# EAGLE design Development Board ATMega32 (EAGLE 7.6.0)

## Sheet 1 of 2
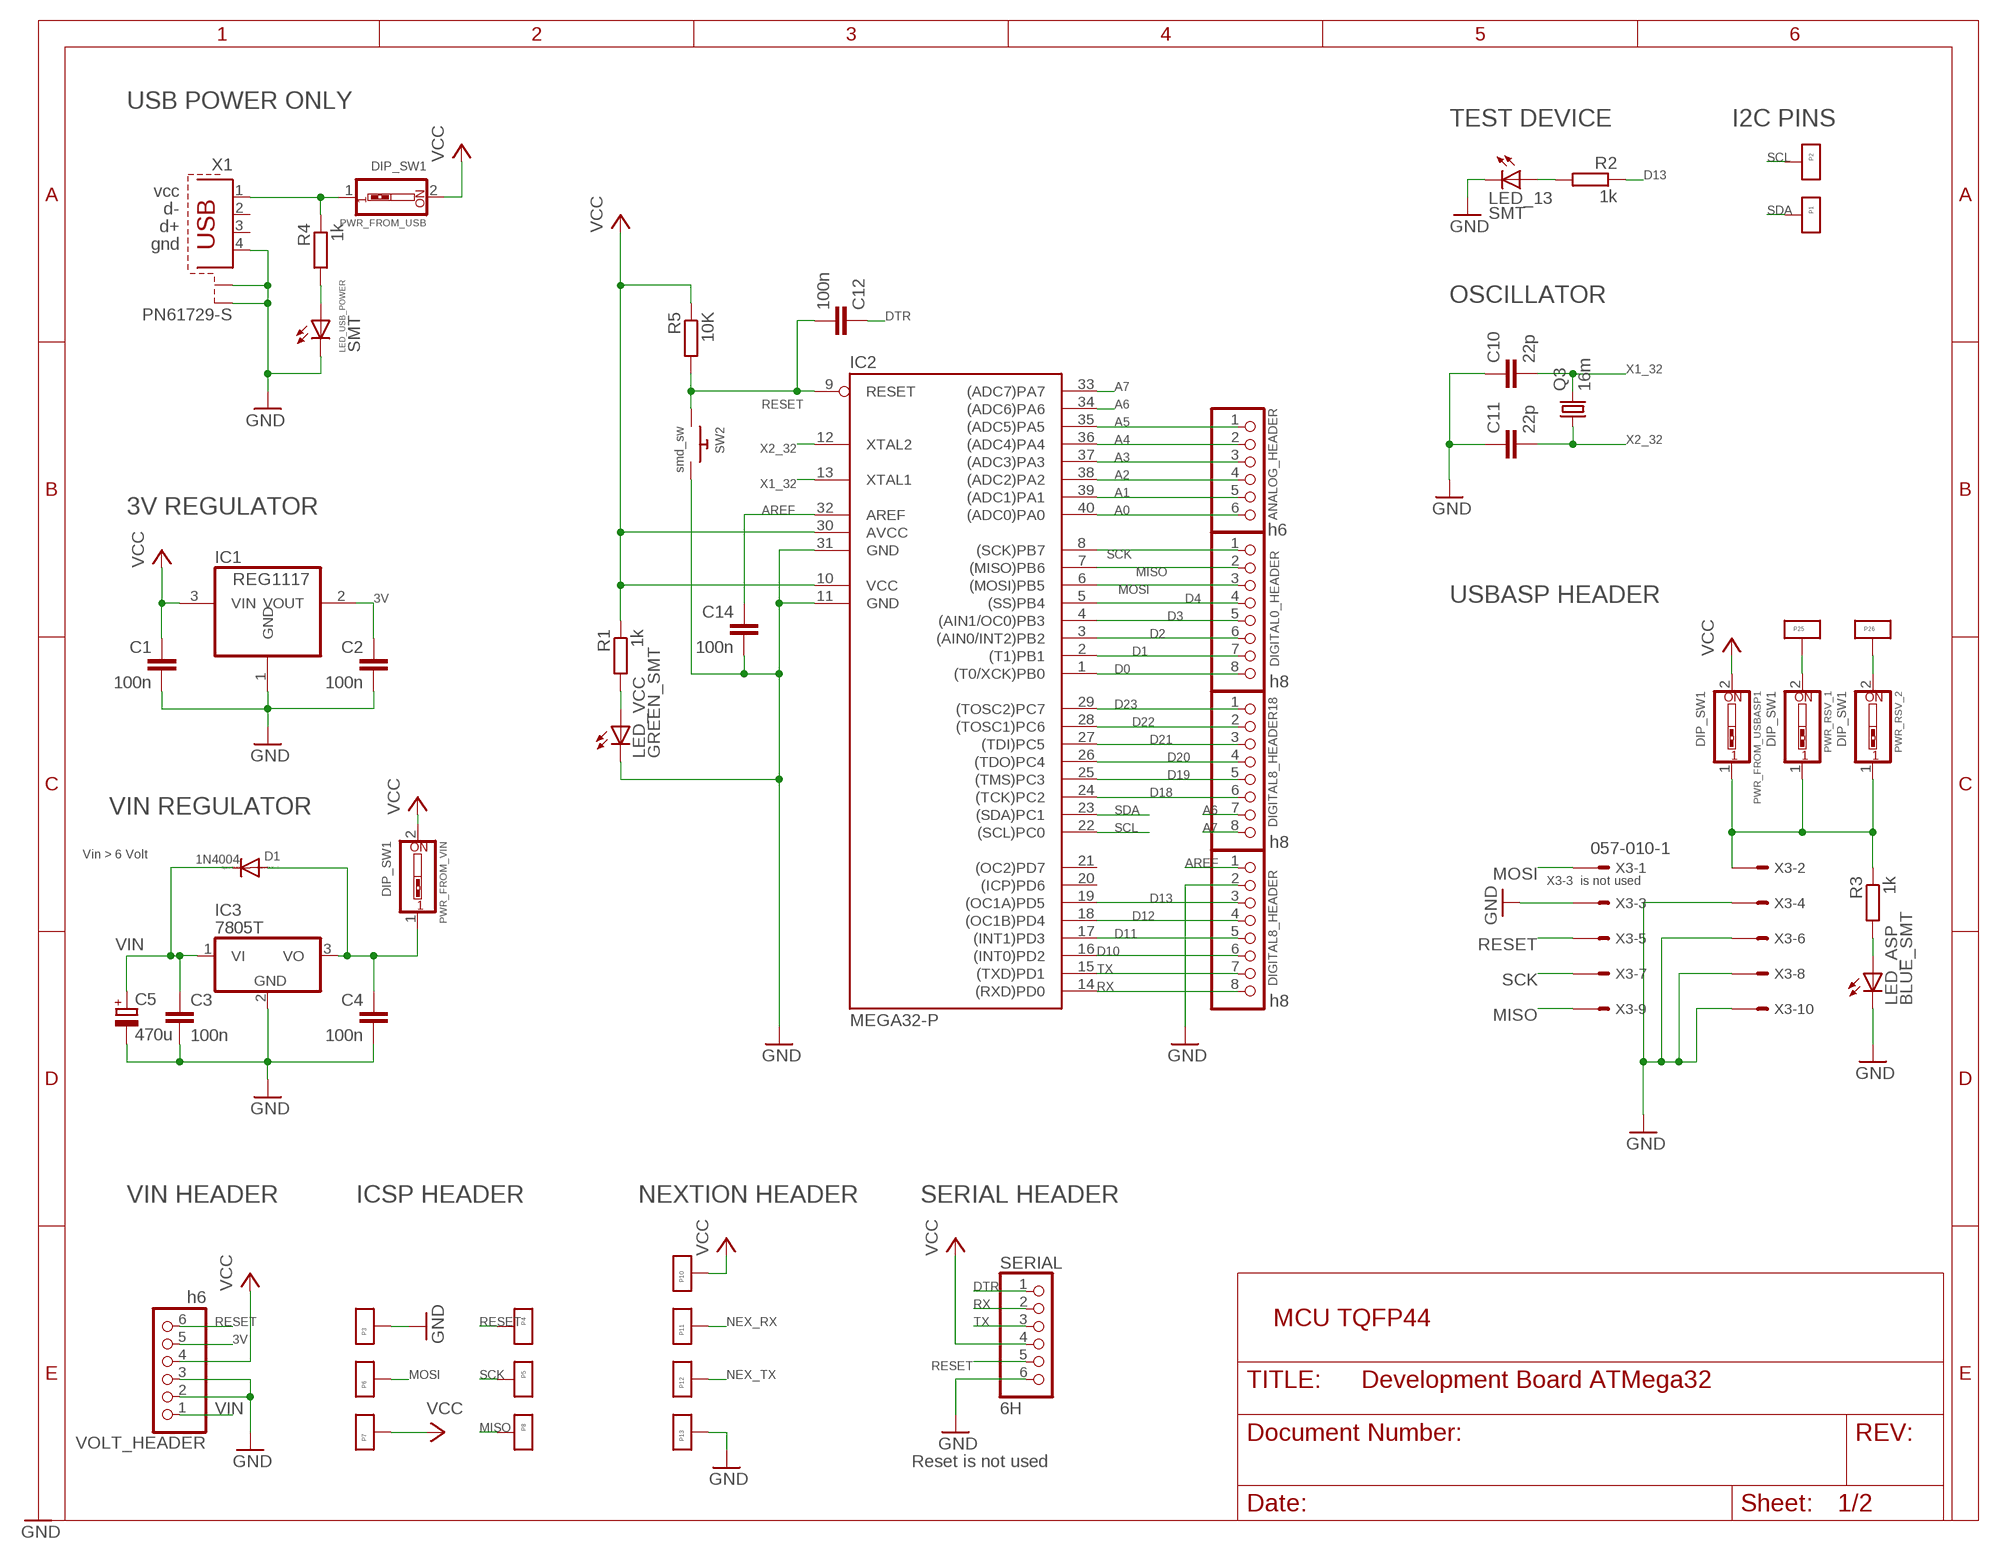
[diagram p0: schematic, sheet 1]

### Parts
ANALOG_HEADER  h6  PINHD-1X6  [1X06]
C1  100n  C-EUC1206  [C1206]
C2  100n  C-EUC1206  [C1206]
C3  100n  C-EU050-025X075  [C050-025X075]
C4  100n  C-EU050-025X075  [C050-025X075]
C5  470u  CPOL-EUE5-5  [E5-5]
C10  22p  C-EUC1206  [C1206]
C11  22p  C-EUC1206  [C1206]
C12  100n  C-EUC1206  [C1206]
C14  100n  C-EUC1206  [C1206]
D1  1N4004  [DO41-10]
DIGITAL0_HEADER  h8  PINHD-1X8BIG  [1X08-BIG]
DIGITAL8_HEADER  h8  PINHD-1X8BIG  [1X08-BIG]
DIGITAL8_HEADER18  h8  PINHD-1X8BIG  [1X08-BIG]
IC1  REG1117  [SOT223]
IC2  MEGA32-P  [DIL40]
IC3  7805T  [TO220H]
LED_13  SMT  LEDSMT1206  [1206]
LED_ASP  BLUE_SMT  LEDSMT1206  [1206]
LED_USB_POWER  SMT  LEDSMT1206  [1206]
LED_VCC  GREEN_SMT  LEDSMT1206  [1206]
P1  PIN-BIG1X  [PIN-BIG]
P2  PIN-BIG1X  [PIN-BIG]
P3  PIN-BIG1X  [PIN-BIG]
P4  PIN-BIG1X  [PIN-BIG]
P5  PIN-BIG1X  [PIN-BIG]
P6  PIN-BIG1X  [PIN-BIG]
P7  PIN-BIG1X  [PIN-BIG]
P8  PIN-BIG1X  [PIN-BIG]
P10  PIN-BIG1X  [PIN-BIG]
P11  PIN-BIG1X  [PIN-BIG]
P12  PIN-BIG1X  [PIN-BIG]
P13  PIN-BIG1X  [PIN-BIG]
P25  PIN-BIG1X  [PIN-BIG]
P26  PIN-BIG1X  [PIN-BIG]
PWR_FROM_USB  DIP_SW1  SW_DIP-1  [EDG-01]
PWR_FROM_USBASP1  DIP_SW1  SW_DIP-1  [EDG-01]
PWR_FROM_VIN  DIP_SW1  SW_DIP-1  [EDG-01]
PWR_RSV_1  DIP_SW1  SW_DIP-1  [EDG-01]
PWR_RSV_2  DIP_SW1  SW_DIP-1  [EDG-01]
Q3  16m  CRYSTALHC49UP  [HC49UP]
R1  1k  R-EU_R1206  [R1206]
R2  1k  R-EU_R1206  [R1206]
R3  1k  R-EU_R1206  [R1206]
R4  1k  R-EU_R1206  [R1206]
R5  10K  R-EU_R1206  [R1206]
SERIAL  6H  PINHD-1X6  [1X06]
SW2  smd_sw  SWITCH_PUSHBUTTONEVQ-PE  [TACT_PANA-EVQ]
VOLT_HEADER  h6  PINHD-1X6  [1X06]
X1  PN61729-S  [PN61729-S]
X3  057-010-1  [057-010-1]

### Nets
3V: C2.1 IC1.2(VOUT) VOLT_HEADER.5
A0: ANALOG_HEADER.6 IC2.40((ADC0)PA0)
A1: ANALOG_HEADER.5 IC2.39((ADC1)PA1)
A2: ANALOG_HEADER.4 IC2.38((ADC2)PA2)
A3: ANALOG_HEADER.3 IC2.37((ADC3)PA3)
A4: ANALOG_HEADER.2 IC2.36((ADC4)PA4)
A5: ANALOG_HEADER.1 IC2.35((ADC5)PA5)
A6: DIGITAL8_HEADER18.7 IC2.34((ADC6)PA6)
A7: DIGITAL8_HEADER18.8 IC2.33((ADC7)PA7)
AREF: C14.1 DIGITAL8_HEADER.1 IC2.32(AREF)
D0: DIGITAL0_HEADER.8 IC2.1((T0/XCK)PB0)
D1: DIGITAL0_HEADER.7 IC2.2((T1)PB1)
D2: DIGITAL0_HEADER.6 IC2.3((AIN0/INT2)PB2)
D3: DIGITAL0_HEADER.5 IC2.4((AIN1/OC0)PB3)
D4: DIGITAL0_HEADER.4 IC2.5((SS)PB4)
D10: DIGITAL8_HEADER.6 IC2.16((INT0)PD2)
D11: DIGITAL8_HEADER.5 IC2.17((INT1)PD3)
D12: DIGITAL8_HEADER.4 IC2.18((OC1B)PD4)
D13: DIGITAL8_HEADER.3 IC2.19((OC1A)PD5) R2.1
D18: DIGITAL8_HEADER18.6 IC2.24((TCK)PC2)
D19: DIGITAL8_HEADER18.5 IC2.25((TMS)PC3)
D20: DIGITAL8_HEADER18.4 IC2.26((TDO)PC4)
D21: DIGITAL8_HEADER18.3 IC2.27((TDI)PC5)
D22: DIGITAL8_HEADER18.2 IC2.28((TOSC1)PC6)
D23: DIGITAL8_HEADER18.1 IC2.29((TOSC2)PC7)
DTR: C12.1 SERIAL.1
GND: C1.2 C2.2 C3.2 C4.2 C5.- C10.1 C11.1 C14.2 DIGITAL8_HEADER.2 IC1.1(GND) IC2.11(GND) IC2.31(GND) IC3.2(GND) LED_13.C LED_ASP.C LED_USB_POWER.C LED_VCC.C P3.P$1 P13.P$1 SERIAL.6 SW2.P$2 VOLT_HEADER.2 VOLT_HEADER.3 X1.4 X1.S1 X1.S2 X3.3 X3.4 X3.6 X3.8 X3.10 ; also sheet 2
MISO: DIGITAL0_HEADER.2 IC2.7((MISO)PB6) P8.P$1 X3.9
MOSI: DIGITAL0_HEADER.3 IC2.6((MOSI)PB5) P6.P$1 X3.1
N$1: LED_VCC.A R1.2
N$2: LED_13.A R2.2
N$3: LED_ASP.A R3.2
N$4: PWR_FROM_USB.1 R4.1 X1.1
N$5: LED_USB_POWER.A R4.2
N$6: C4.1 D1.A IC3.3(VO) PWR_FROM_VIN.1
N$60: PWR_FROM_USBASP1.1 PWR_RSV_1.1 PWR_RSV_2.1 R3.1 X3.2
NEX_RX: P11.P$1 ; also sheet 2
NEX_TX: P12.P$1 ; also sheet 2
RESET: C12.2 IC2.9(RESET) P4.P$1 R5.2 SERIAL.5 SW2.P$1 VOLT_HEADER.6 X3.5
RSV1: P25.P$1 PWR_RSV_1.2
RSV2: P26.P$1 PWR_RSV_2.2
RX: DIGITAL8_HEADER.8 IC2.14((RXD)PD0) SERIAL.2
SCK: DIGITAL0_HEADER.1 IC2.8((SCK)PB7) P5.P$1 X3.7
SCL: IC2.22((SCL)PC0) P2.P$1
SDA: IC2.23((SDA)PC1) P1.P$1
TX: DIGITAL8_HEADER.7 IC2.15((TXD)PD1) SERIAL.3
VCC: C1.1 IC1.3(VIN) IC2.10(VCC) IC2.30(AVCC) P7.P$1 P10.P$1 PWR_FROM_USB.2 PWR_FROM_USBASP1.2 PWR_FROM_VIN.2 R1.1 R5.1 SERIAL.4 VOLT_HEADER.4 ; also sheet 2
VIN: C3.1 C5.+ D1.C IC3.1(VI) VOLT_HEADER.1
X1_32: C10.2 IC2.13(XTAL1) Q3.2
X2_32: C11.2 IC2.12(XTAL2) Q3.1
Unconnected: IC2.20((ICP)PD6) IC2.21((OC2)PD7) X1.2 X1.3

### Notes on the sheet
- USB POWER ONLY
- TEST DEVICE | I2C PINS
- vcc
- d-
- d+
- gnd
- OSCILLATOR
- 3V REGULATOR
- USBASP HEADER
- VIN REGULATOR
- Vin > 6 Volt
- X3-3  is not used
- VIN HEADER | ICSP HEADER | NEXTION HEADER | SERIAL HEADER
- MCU TQFP44
- Reset is not used

## Sheet 2 of 2
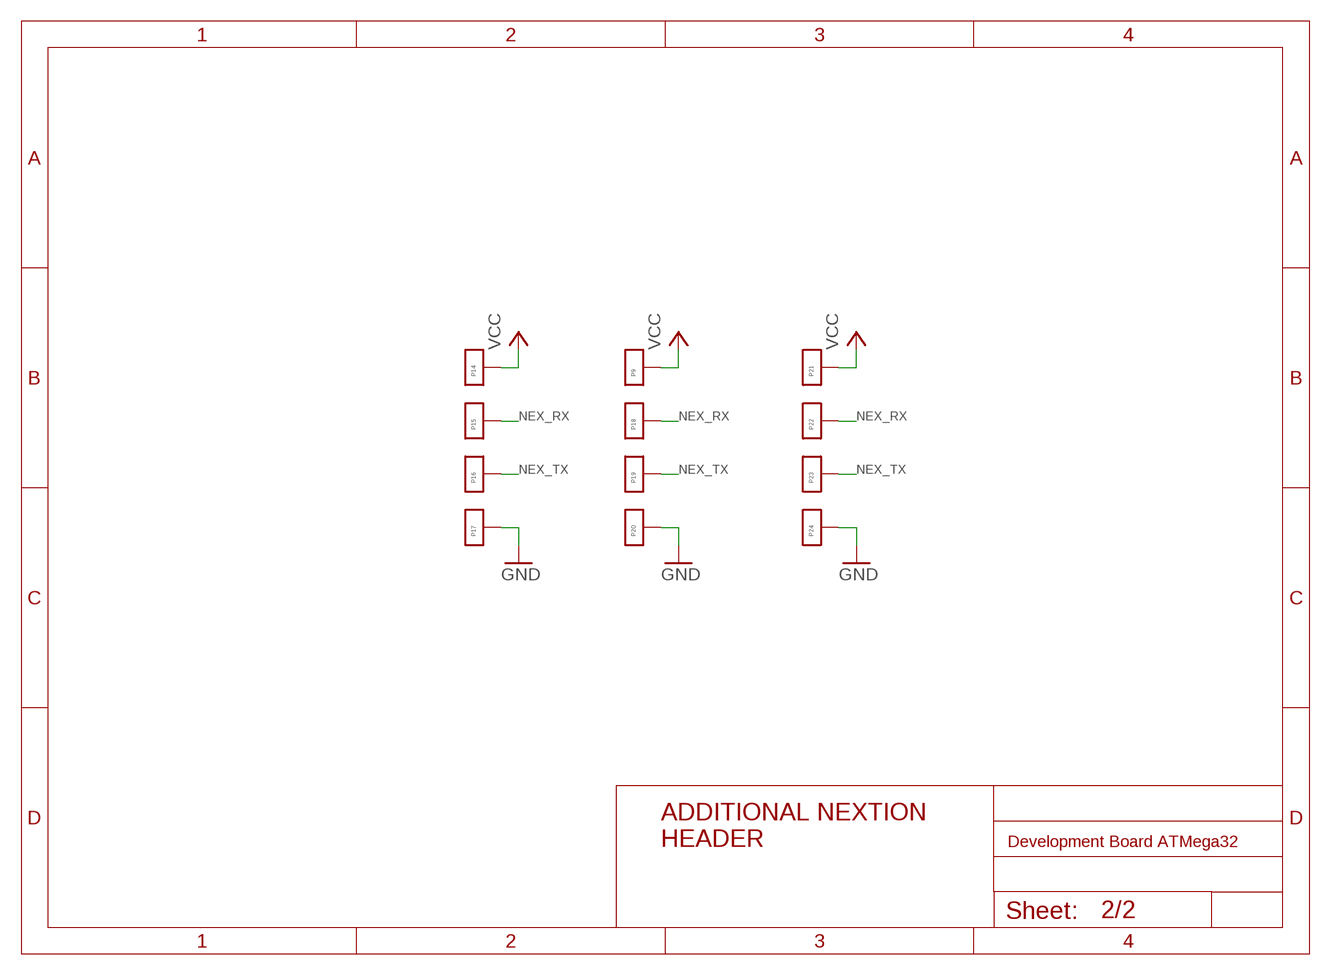
[diagram p1: schematic, sheet 2]

### Parts
P9  PIN-BIG1X  [PIN-BIG]
P14  PIN-BIG1X  [PIN-BIG]
P15  PIN-BIG1X  [PIN-BIG]
P16  PIN-BIG1X  [PIN-BIG]
P17  PIN-BIG1X  [PIN-BIG]
P18  PIN-BIG1X  [PIN-BIG]
P19  PIN-BIG1X  [PIN-BIG]
P20  PIN-BIG1X  [PIN-BIG]
P21  PIN-BIG1X  [PIN-BIG]
P22  PIN-BIG1X  [PIN-BIG]
P23  PIN-BIG1X  [PIN-BIG]
P24  PIN-BIG1X  [PIN-BIG]

### Nets
GND: P17.P$1 P20.P$1 P24.P$1 ; also sheet 1
NEX_RX: P15.P$1 P18.P$1 P22.P$1 ; also sheet 1
NEX_TX: P16.P$1 P19.P$1 P23.P$1 ; also sheet 1
VCC: P9.P$1 P14.P$1 P21.P$1 ; also sheet 1

### Notes on the sheet
- ADDITIONAL NEXTION 
  HEADER

## Library data of the parts
ANALOG_HEADER SERIAL VOLT_HEADER = adafruit:PINHD-1X6: PIN HEADER
C1-C4 C10-C12 C14 = resistor:C-EU: CAPACITOR, European symbol
C5 = resistor:CPOL-EU: POLARIZED CAPACITOR, European symbol
D1 = diode:1N4004: DIODE general purpose rectifier, 1 A
DIGITAL0_HEADER DIGITAL8_HEADER DIGITAL8_HEADER18 = adafruit:PINHD-1X8: PIN HEADER
IC1 = burr-brown:REG1117: 800mA and 1A Low Dropout (LDO) Positive Regulator 1.8V, 2.5V, 2.85V, 3.3V, 5V, and Adj; MPN: REG1117; OC_FARNELL: 1097566; OC_NEWARK: 14P6981
IC2 = atmel:MEGA32-P: MICROCONTROLLER 32 Kbytes FLASH 2 Kbytes SRAM 1 Kbytes EEPROM USART 8-channel 10 bit ADC Source: www.atmel.com .. doc2503.pdf; MPN: ATMEGA32-16PU; OC_FARNELL: 1661729; OC_NEWARK: 51P1794
IC3 = adafruit:78*: Positive VOLTAGE REGULATOR Added bigger pads to the TO-92 package
LED_13 LED_ASP LED_USB_POWER LED_VCC = adafruit:LED: LED OSRAM: - CHIPLED LG R971, LG N971, LY N971, LG Q971, LY Q971, LO R971, LY R971 LH N974, LH R974 LS Q976, LO Q976, LY Q976 LO Q996 - Hyper CHIPLED LW Q18S LB Q993, LB Q99A, LB R99A - SideLED LS A670, LO A670, LY A670, LG A670, LP A670 LB A673, LV A673, LT A673, LW A673 LH A674 LY A675 LS A676, LA A676, LO A676, LY A676, LW A676 LS A679, LY A679, LG A679 - Hyper Micro SIDELED® LS Y876, LA Y876, LO Y876, LY Y876 LT Y87S - SmartLED LW L88C, LW L88S LB L89C, LB L89S, LG L890 LS L89K, LO L89K, LY L89K LS L896, LA L896, LO L896, LY L896 - TOPLED LS T670, LO T670, LY T670, LG T670, LP T670 LSG T670, LSP T670, LSY T670, LOP T670, LYG T670 LG T671, LOG T671, LSG T671 LB T673, LV T673, LT T673, LW T673 LH T674 LS T676, LA T676, LO T676, LY T676, LB T676, LH T676, LSB T676, LW T676 LB T67C, LV T67C, LT T67C, LS T67K, LO T67K, LY T67K, LW E67C LS E67B, LA E67B, LO E67B, LY E67B, LB E67C, LV E67C, LT E67C LW T67C LS T679, LY T679, LG T679 LS T770, LO T770, LY T770, LG T770, LP T770 LB T773, LV T773, LT T773, LW T773 LH T774 LS E675, LA E675, LY E675, LS T675 LS T776, LA T776, LO T776, LY T776, LB T776 LHGB T686 LT T68C, LB T68C - Hyper Mini TOPLED® LB M676 - Mini TOPLED Santana® LG M470 LS M47K, LO M47K, LY M47K Source: http://www.osram.convergy.de/
P1-P26 = ioshub:PIN-BIG: 1X 1.0 mm pin big
PWR_FROM_USB PWR_FROM_USBASP1 PWR_FROM_VIN PWR_RSV_1 PWR_RSV_2 = special:SW_DIP-1: DIP SWITCH
Q3 = adafruit:CRYSTAL: CRYSTAL; OC_FARNELL: unknown; OC_NEWARK: unknown
R1-R5 = resistor:R-EU_: RESISTOR, European symbol
SW2 = adafruit:SWITCH_PUSHBUTTON: Buttons SOFTTOUCHSMD_SJ - Soft touch temporary push button (Super Junk Akihabara) Compatible with SKPMANE010 [Mouser: 688-SKPMAN] C&K_KSS = Digikey: KSS221GLFS
X1 = con-berg:PN61729-S: BERG USB connector; OC_FARNELL: unknown; OC_NEWARK: unknown
X3 = con-panduit:057-010-: CONNECTOR 10-pin series 057 contact pc board low profile headers; OC_FARNELL: unknown; OC_NEWARK: unknown

## Board
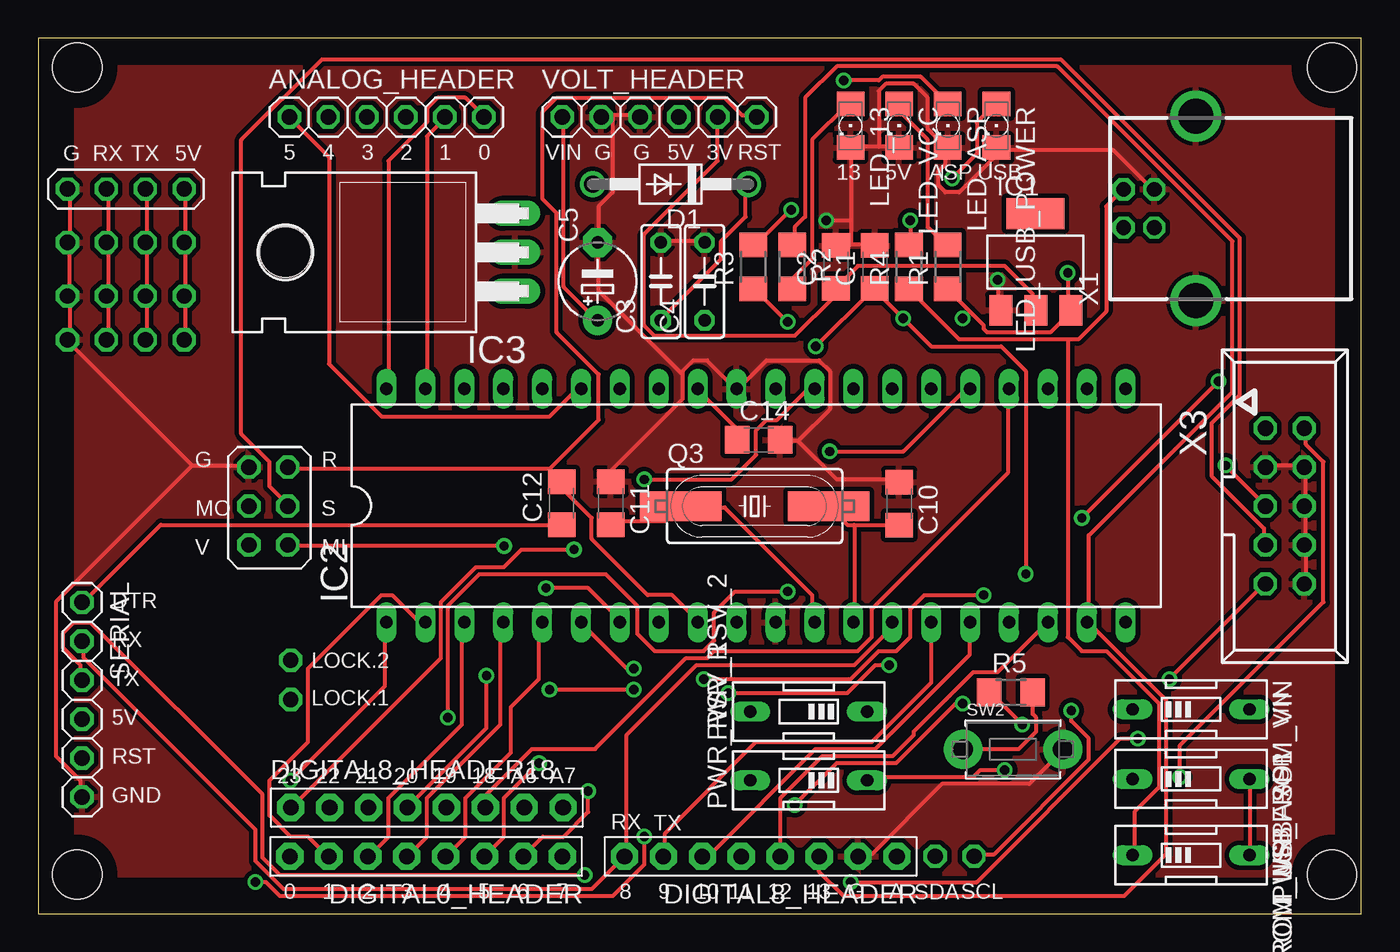
[diagram p2: board, top side]
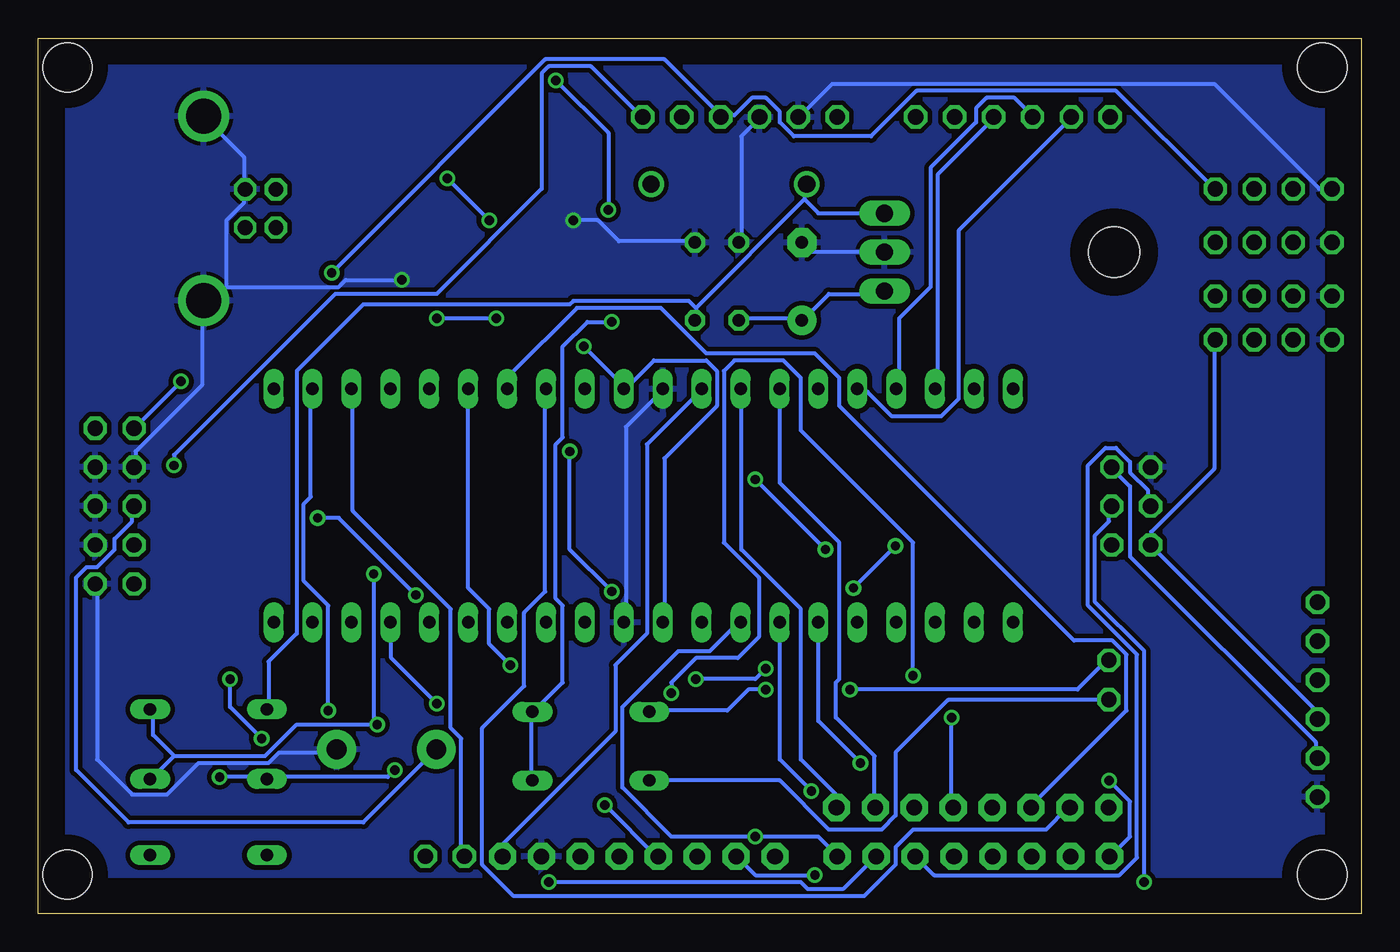
[diagram p3: board, bottom side, seen from below]

Size 86.36 x 57.15 mm. Coordinates in mm from the lower left corner, seen from the top.
Outline: 0,0 86.36,0 86.36,57.15 0,57.15 0,0
Copper layers (1*16): Top 0.035mm / dielectric 1.5mm / Bottom 0.035mm
Design rules "default": minimum track width 10mil, minimum drill 24mil, track to track 8mil, track to pad 8mil, pad to pad 8mil, via to via 8mil, smd to smd 8mil, copper to edge 40mil, drill to drill 8mil, minimum pad ring 10mil, minimum via ring 8mil, stop-mask expansion 4mil, vias tented up to drill 0mil, thermal gap 10mil
Holes 3.2 mm at 2.54,55.24 2.54,2.54 84.45,2.54 84.45,55.24

### Footprints (pad centres in the part's own frame; a part is rotated, then mirrored left to right if it is on the bottom)
1X06 = drill 1.016 octagon: 1 -6.35,0; 2 -3.81,0; 3 -1.27,0; 4 1.27,0; 5 3.81,0; 6 6.35,0
C1206 = smd 1.6 x 1.8: 1 -1.4,0; 2 1.4,0
C050-025X075 = drill 0.813 octagon: 1 -2.54,0; 2 2.54,0
E5-5 = drill 0.813 pad 1.905: + -2.54,0 | drill 0.813 pad 1.905 octagon: - 2.54,0
DO41-10 = drill 1.118: A 5.08,0; C -5.08,0
1X08-BIG = drill 1.016 pad 1.778 octagon: 1 -8.89,0; 2 -6.35,0; 3 -3.81,0; 4 -1.27,0; 5 1.27,0; 6 3.81,0; 7 6.35,0; 8 8.89,0
SOT223 = smd 1.499 x 2.007: 1 -2.261,-3.15; 2 0.025,-3.15; 3 2.311,-3.15 | smd 3.81 x 2.007: 4 0,3.15
DIL40 = drill 0.813 long: 1 -24.13,-7.62; 2 -21.59,-7.62; 3 -19.05,-7.62; 4 -16.51,-7.62; 5 -13.97,-7.62; 6 -11.43,-7.62; 7 -8.89,-7.62; 8 -6.35,-7.62; 9 -3.81,-7.62; 10 -1.27,-7.62; 11 1.27,-7.62; 12 3.81,-7.62; 13 6.35,-7.62; 14 8.89,-7.62; 15 11.43,-7.62; 16 13.97,-7.62; 17 16.51,-7.62; 18 19.05,-7.62; 19 21.59,-7.62; 20 24.13,-7.62; 21 24.13,7.62; 22 21.59,7.62; 23 19.05,7.62; 24 16.51,7.62; 25 13.97,7.62; 26 11.43,7.62; 27 8.89,7.62; 28 6.35,7.62; 29 3.81,7.62; 30 1.27,7.62; 31 -1.27,7.62; 32 -3.81,7.62; 33 -6.35,7.62; 34 -8.89,7.62; 35 -11.43,7.62; 36 -13.97,7.62; 37 -16.51,7.62; 38 -19.05,7.62; 39 -21.59,7.62; 40 -24.13,7.62
TO220H = drill 1.118 long: 1 -2.54,-10.16; 2 0,-10.16; 3 2.54,-10.16 | hole 3.302: 0,4.826
1206 = smd 1.6 x 1.803: A -1.422,0; C 1.422,0
PIN-BIG = drill 1 octagon: P$1 0,0
EDG-01 = drill 0.813 long: 1 0,-3.81; 2 0,3.81
HC49UP = smd 5.334 x 1.93: 1 -4.826,0; 2 4.826,0
R1206 = smd 1.6 x 1.803: 1 -1.422,0; 2 1.422,0
TACT_PANA-EVQ = drill 1.3 pad 2.54: P$1 -3.25,0; P$2 3.25,0
PN61729-S = drill 0.95 octagon: 1 1.25,4.71; 2 -1.25,4.71; 3 -1.25,2.71; 4 1.25,2.71 | drill 2.3 pad 2.9: S1 -6.02,0; S2 6.02,0
057-010-1 = drill 1 octagon: 1 -5.08,-1.27; 2 -5.08,1.27; 3 -2.54,-1.27; 4 -2.54,1.27; 5 0,-1.27; 6 0,1.27; 7 2.54,-1.27; 8 2.54,1.27; 9 5.08,-1.27; 10 5.08,1.27

### Placement (x,y rotation side)
ANALOG_HEADER  22.73,52.01 0 top
C1  54.61,42.23 90 top
C2  52.07,42.23 90 top
C3  40.64,41.27 90 top
C4  43.5,41.27 90 top
C5  36.51,41.27 90 top
C10  56.2,26.77 270 top
C11  37.37,26.8 270 top
C12  34.16,26.8 90 top
C14  47.02,30.92 0 top
D1  41.27,47.62 180 top
DIGITAL0_HEADER  25.32,3.73 180 top
DIGITAL8_HEADER  47.16,3.73 180 top
DIGITAL8_HEADER18  25.37,6.92 0 top
IC1  65.09,42.55 0 top
IC2  46.86,26.64 0 top
IC3  20.95,43.18 90 top
LED_13  53.02,51.44 270 top
LED_ASP  59.37,51.44 270 top
LED_USB_POWER  62.55,51.44 270 top
LED_VCC  56.2,51.44 270 top
P1  58.55,3.75 0 top
P2  61.09,3.75 0 top
P3  13.75,29.15 0 top
P4  16.29,29.15 0 top
P5  16.29,26.61 0 top
P6  13.75,26.61 0 top
P7  13.75,24.07 0 top
P8  16.29,24.07 0 top
P9  9.53,40.32 0 top
P10  9.53,47.31 270 top
P11  4.45,47.31 270 top
P12  6.99,47.31 270 top
P13  1.91,47.31 270 top
P14  9.53,43.81 0 top
P15  4.45,43.81 0 top
P16  6.99,43.81 0 top
P17  1.91,43.81 0 top
P18  4.45,40.32 0 top
P19  6.99,40.32 0 top
P20  1.91,40.32 0 top
P21  9.53,37.47 0 top
P22  4.45,37.47 0 top
P23  6.99,37.47 0 top
P24  1.91,37.47 0 top
P25  16.48,13.97 0 top
P26  16.48,16.54 0 top
PWR_FROM_USB  75.25,3.81 270 top
PWR_FROM_USBASP1  75.25,8.79 270 top
PWR_FROM_VIN  75.25,13.34 270 top
PWR_RSV_1  50.29,8.7 90 top
PWR_RSV_2  50.29,13.18 90 top
Q3  46.77,26.61 0 top
R1  59.37,42.23 90 top
R2  49.21,42.23 270 top
R3  46.67,42.23 90 top
R4  56.83,42.23 90 top
R5  63.5,14.45 0 top
SERIAL  2.86,13.97 270 top
SW2  63.63,10.73 0 top
VOLT_HEADER  40.55,52.01 0 top
X1  75.56,46.04 90 top
X3  81.38,26.61 270 top

### Tracks (layer width: path | path; a pad name or v marks a point on that pad's centre or on a via)
3V
  Top 0.254: IC1.2 64.92,39.55 64.92,40.46 63.09,42.29 53.49,42.29 52.12,40.92 C2.1 51.89,40.69 51.89,40.23 49.38,37.72 40.23,37.72 39.55,38.41 39.55,44.35 44.35,49.15 44.35,51.89 VOLT_HEADER.5
A0
  Top 0.254: IC2.40 22.86,34.29 22.86,49.15 25.38,51.66 25.38,52.58 26.06,53.26 27.89,53.26 29.03,52.12 ANALOG_HEADER.6
A1
  Top 0.254: IC2.39 25.38,34.29 25.38,50.75 26.52,51.89 ANALOG_HEADER.5
A2
  Bottom 0.254: IC2.38 27.66,34.29 27.66,48.23 24,51.89 ANALOG_HEADER.4
A3
  Bottom 0.254: IC2.37 30.18,34.29 30.18,38.86 28.12,40.92 28.12,48.69 25.15,51.66 25.15,52.58 24.46,53.26 22.63,53.26 21.49,52.12 ANALOG_HEADER.3
A4
  Bottom 0.254: IC2.36 32.69,34.06 32.23,34.06 30.63,32.46 27.43,32.46 26.29,33.6 26.29,44.58 18.97,51.89 ANALOG_HEADER.2
A5
  Top 0.254: IC2.35 35.43,34.06 34.98,34.06 33.38,32.46 22.4,32.46 18.97,35.89 18.97,49.38 16.46,51.89 ANALOG_HEADER.1
A6
  Bottom 0.254: IC2.34 37.95,34.06 37.95,28.12 34.06,24.23 34.06,15.32 34.29,15.09 34.29,12.8 31.77,10.29 31.77,7.09 DIGITAL8_HEADER18.7
A7
  Bottom 0.254: IC2.33 40.46,34.06 40.46,23.77 36.58,19.89 36.58,10.06 34.29,7.77 34.29,7.09 DIGITAL8_HEADER18.8
AREF
  Top 0.254: C14.1 45.49,31.09 45.49,31.77 43.2,34.06 IC2.32
  Bottom 0.254: DIGITAL8_HEADER.1 56.01,3.89 56.01,4.57 48.69,11.89 48.69,16.23 46.63,18.29 46.63,30.63 43.2,34.06 IC2.32
D0  (via drill 0.61)
  Top 0.254: v16.46,8.69 22.63,14.86 22.63,18.97 IC2.1
  Bottom 0.254: v16.46,8.69 15.09,7.32 15.09,5.03 16.23,3.89 DIGITAL0_HEADER.8
D1
  Top 0.254: IC2.2 25.15,19.2 24.69,19.2 23.09,20.8 22.4,20.8 17.6,16 17.6,11.2 15.09,8.69 15.09,6.4 16.46,5.03 17.6,5.03 18.75,3.89 DIGITAL0_HEADER.7
D2
  Top 0.254: IC2.3 27.66,18.97 27.66,12.34 22.86,7.54 22.86,5.03 21.72,3.89 DIGITAL0_HEADER.6
D3
  Top 0.254: IC2.4 30.18,18.97 30.18,12.34 25.38,7.54 25.38,5.03 24.23,3.89 DIGITAL0_HEADER.5
D4
  Top 0.254: IC2.5 32.69,18.97 32.69,15.32 30.86,13.49 30.86,10.52 27.89,7.54 27.89,5.03 26.75,3.89 DIGITAL0_HEADER.4
D10
  Top 0.254: IC2.16 60.81,18.97 60.81,16.92 54.63,10.74 50.75,10.74 43.89,3.89 43.43,3.89 DIGITAL8_HEADER.6
D11  (via drill 0.61)
  Top 0.254: v60.35,13.72 59.89,13.72 56.01,9.83 52.12,9.83 v49.38,7.09
  Bottom 0.254: v60.35,13.72 63.32,16.69 63.32,18.97 IC2.17 | v49.38,7.09 45.95,3.66 DIGITAL8_HEADER.5
D12
  Top 0.254: IC2.18 65.84,18.97 62.64,15.77 61.04,15.77 57.15,11.89 57.15,11.66 55.78,10.29 51.21,10.29 48.46,7.54 48.46,3.89 DIGITAL8_HEADER.4
D13
  Top 0.254: R2.1 49.38,43.66 49.38,44.81 50.06,45.49 50.06,53.26 52.12,55.32 66.52,55.32 77.95,43.89 77.95,34.06 68.58,24.69 68.58,19.2 IC2.19 68.58,18.97 73.61,13.95 73.61,3.89 70.87,1.14 52.58,1.14 50.98,2.74 50.98,3.66 DIGITAL8_HEADER.3
D18
  Top 0.254: IC2.24 63.32,34.06 63.32,28.8 54.41,19.89 54.41,18.06 53.49,17.14 44.12,17.14 43.66,16.69 42.29,16.69 36.35,10.74 32.23,10.74 29.26,7.77 29.26,7.09 DIGITAL8_HEADER18.6
D19  (via drill 0.61)
  Top 0.254: v51.66,30.18 56.46,30.18 60.35,34.06 60.81,34.06 IC2.25 | v48.92,21.03 45.49,21.03 44.12,19.66 44.12,17.83 43.43,17.14 40.23,17.14 39.09,18.29 39.09,20.12 37.03,22.17 28.8,22.17 26.75,20.12 v26.75,12.8
  Bottom 0.254: v51.66,30.18 51.66,23.77 v48.92,21.03 | v26.75,12.8 26.75,7.09 DIGITAL8_HEADER18.5
D20  (via drill 0.61)
  Top 0.254: v55.55,16.23 54.63,16.23 52.81,14.4 v45.03,14.4 | v29.26,15.54 29.26,12.12 24.23,7.09 DIGITAL8_HEADER18.4
  Bottom 0.254: IC2.26 58.29,21.26 56.92,19.89 56.92,17.6 v55.55,16.23 | v45.03,14.4 45.03,15.09 43.43,16.69 40.69,16.69 39.32,18.06 39.32,21.95 41.6,24.23 41.6,35.43 40.92,36.12 37.72,36.12 36.58,34.98 36.58,31.55 29.26,24.23 v29.26,15.54
D21
  Bottom 0.254: IC2.27 55.55,34.29 55.55,35.2 51.21,39.55 45.72,39.55 42.75,36.58 35.66,36.58 34.06,34.98 34.06,33.15 18.75,17.83 16.23,17.83 15.32,16.92 15.32,13.26 21.49,7.09 DIGITAL8_HEADER18.3
D22
  Bottom 0.254: IC2.28 53.26,34.06 53.26,21.03 54.63,19.66 54.63,14.86 57.38,12.12 57.38,3.2 55.32,1.14 32.46,1.14 30.4,3.2 30.4,4.34 29.26,5.49 20.57,5.49 19.2,6.86 DIGITAL8_HEADER18.2
D23  (via drill 0.61)
  Top 0.254: v39.55,28.35 45.26,28.35 46.86,29.95 46.86,31.55 47.55,32.23 48.23,32.23 50.06,34.06 50.52,34.06 IC2.29 | v34.98,23.77 31.55,23.77 30.4,22.63 28.57,22.63 26.29,20.34 26.29,16.69 16.69,7.09 DIGITAL8_HEADER18.1
  Bottom 0.254: v34.98,23.77 v39.55,28.35
DTR
  Top 0.254: C12.1 34.06,25.38 8,25.38 2.97,20.34 SERIAL.1
GND  (via drill 0.61)
  Top 0.254: 53.03,43.66 54.41,43.66 C1.2 | 53.03,43.66 52.12,43.66 C2.2 | 54.86,50.06 56.01,50.06 LED_VCC.C | 54.86,50.06 53.03,50.06 LED_13.C 53.03,49.84 53.03,45.26 | 53.03,45.26 53.03,43.66 | X1.4 72.69,47.32 70.18,49.84 62.64,49.84 LED_USB_POWER.C 62.41,49.84 62.41,49.38 60.12,47.09 59.21,47.09 58.75,47.55 58.75,48.46 59.21,48.92 59.21,49.84 LED_ASP.C 59.21,50.06 58.06,51.21 58.06,53.26 57.15,54.18 55.32,54.18 54.86,53.72 54.86,50.06 | DIGITAL8_HEADER.2 53.72,3.89 54.41,3.89 58.98,8.46 64.69,8.46 66.75,10.52 SW2.P$2 | X3.3 80.24,29.26 82.53,29.26 X3.4 82.75,29.03 82.75,26.75 X3.6 82.75,26.52 82.75,24.23 X3.8 82.75,24 82.75,21.72 X3.10 | v62.64,41.38 62.64,39.55 IC1.1 | P13.P$1 2.06,47.09 2.06,43.89 P17.P$1 2.06,43.66 2.06,40.46 P20.P$1 2.06,40.23 2.06,37.49 P24.P$1 2.06,37.26 10.06,29.26 | 10.06,29.26 13.72,29.26 P3.P$1 | 10.06,29.26 1.14,20.34 1.14,10.29 2.74,8.69 2.74,7.77 SERIAL.6 | C3.2 40.69,43.89 43.43,43.89 C4.2 | 37.49,52.12 39.09,52.12 VOLT_HEADER.3 | 37.49,52.12 36.8,52.12 VOLT_HEADER.2 37.49,52.12 | 37.49,52.12 37.49,47.09 36.58,46.18 36.58,43.89 C5.- 36.58,43.66 36.58,40.69 42.06,35.2 | 49.61,30.86 48.46,30.86 C14.2 | 49.61,30.86 52.12,28.35 56.01,28.35 C10.1 | 42.06,35.2 42.06,35.43 42.75,36.12 43.66,36.12 45.49,34.29 IC2.31 45.72,34.29 47.55,36.12 50.98,36.12 51.66,35.43 51.66,32.92 49.61,30.86 | 42.06,35.2 42.06,33.6 37.49,29.03 37.49,28.35 C11.1 | v51.44,45.26 53.03,45.26
  Bottom 0.254: X1.S2 75.44,51.89 72.92,49.38 72.92,47.32 X1.4 72.92,47.09 72.92,46.41 74.07,45.26 74.07,40.92 | v62.64,41.38 66.29,41.38 66.75,40.92 74.07,40.92 | 74.07,40.92 74.75,40.92 75.44,40.23 X1.S1 75.67,40.01 75.67,34.52 80.01,30.18 80.01,29.26 X3.3 | SW2.P$2 66.98,10.52 70.64,10.52 71.32,9.83 75.89,9.83 77.95,7.77 80.24,7.77 82.53,10.06 82.53,21.49 X3.10 | IC3.2 31.32,43.2 35.89,43.2 36.35,43.66 C5.- | C3.2 40.46,43.89 40.46,50.75 39.32,51.89 VOLT_HEADER.3 | IC2.11 48.01,19.2 48.01,31.77 45.72,34.06 IC2.31 | P13.P$1 2.06,47.32 2.74,47.32 9.6,54.18 34.52,54.18 36.58,52.12 VOLT_HEADER.2 | v51.44,45.26 49.84,45.26 48.46,43.89 43.66,43.89 C4.2
  pour Bottom (isolate 0.305): 2.54,55.24 84.45,55.24 84.45,2.54 2.54,2.54
  pour Top (isolate 0.305): 2.54,55.24 84.45,55.24 84.45,2.54 2.54,2.54
MISO  (via drill 0.61)
  Top 0.254: v35.89,8 35.89,6.63 34.29,5.03 32.92,5.03 31.77,3.89 DIGITAL0_HEADER.2 | v30.4,24 16.46,24 P8.P$1 | v33.15,21.26 35.89,21.26 37.95,19.2 IC2.7 | v73.84,15.32 80.01,21.49 X3.9 | v71.78,11.43 70.64,11.43 61.27,2.06 v53.03,2.06
  Bottom 0.254: v35.89,8 37.95,10.06 37.95,18.97 IC2.7 | v33.15,21.26 v30.4,24 | v73.84,15.32 73.84,13.49 v71.78,11.43 | v53.03,2.06 36.58,2.06 36.12,1.6 33.83,1.6 31.77,3.66 DIGITAL0_HEADER.2
MOSI  (via drill 0.61)
  Top 0.254: v32.69,9.83 30.4,7.54 30.4,5.03 29.26,3.89 DIGITAL0_HEADER.3 | v68.12,25.83 v77.04,34.75 | v61.72,20.8 57.84,20.8 56.92,19.89 56.92,18.06 56.01,17.14 54.86,17.14 53.03,15.32 v43.43,15.32 | v38.86,16 38.41,16 35.43,18.97 IC2.6
  Bottom 0.254: IC2.6 35.43,12.57 v32.69,9.83 | P6.P$1 13.95,26.75 13.95,27.66 15.09,28.8 15.09,29.49 16,30.4 16.69,30.4 17.83,29.26 17.83,20.12 14.63,16.92 14.63,3.66 15.77,2.52 27.89,2.52 29.03,3.66 DIGITAL0_HEADER.3 | v77.04,34.75 80.01,31.77 X3.1 | v68.12,25.83 66.75,25.83 v61.72,20.8 | v43.43,15.32 39.55,15.32 v38.86,16
N$1
  Top 0.254: LED_VCC.A 56.24,52.81 56.24,52.35 58.06,50.52 58.06,44.81 59.21,43.66 R1.2
N$2
  Top 0.254: R2.2 49.38,40.92 49.38,41.6 50.52,42.75 50.52,50.52 52.81,52.81 LED_13.A
N$3  (via drill 0.61)
  Top 0.254: v49.15,45.95 46.86,43.66 R3.2 | v52.58,54.41 54.86,54.41 55.09,54.63 57.61,54.63 59.21,53.03 LED_ASP.A
  Bottom 0.254: v49.15,45.95 49.15,50.98 v52.58,54.41
N$4
  Top 0.254: 67.21,37.49 67.89,37.49 69.72,39.32 69.72,46.18 70.64,47.09 X1.1 | 67.21,37.49 60.12,37.49 56.92,40.69 R4.1 | 67.21,37.49 67.21,18.06 68.12,17.14 69.72,17.14 73.15,13.72 73.15,8.23 71.55,6.63 71.55,3.89 PWR_FROM_USB.1
N$5  (via drill 0.61)
  Top 0.254: v56.92,45.26 56.92,43.66 R4.2 | v59.66,48.01 61.27,49.61 61.27,51.66 62.41,52.81 LED_USB_POWER.A
  Bottom 0.254: v59.66,48.01 v56.92,45.26
N$6
  Bottom 0.254: 43.43,39.55 43.43,38.86 C4.1 | 36.35,46.63 43.43,39.55 | 36.35,46.63 36.35,47.55 D1.A | 43.43,39.55 43.89,40.01 51.44,40.01 51.66,39.78 65.15,39.78 69.49,35.43 69.49,18.29 71.32,16.46 71.32,13.49 PWR_FROM_VIN.1 | IC3.3 35.43,45.72 36.35,46.63
N$60  (via drill 0.61)
  Top 0.254: v48.92,38.63 46.86,40.69 R3.1 | v63.09,9.37 61.49,9.37 61.04,8.91 54.18,8.91 PWR_RSV_1.1 | v74.52,8.91 74.52,10.97 83.9,20.34 83.9,29.49 82.75,30.63 82.75,31.55 X3.2
  Bottom 0.254: v48.92,38.63 50.52,38.63 52.12,37.03 52.12,31.09 52.58,30.63 52.58,20.57 52.12,20.12 52.12,15.09 53.95,13.26 PWR_RSV_2.1 54.18,13.03 54.18,8.91 PWR_RSV_1.1 | v63.09,9.37 63.55,8.91 71.32,8.91 PWR_FROM_USBASP1.1 71.55,8.91 v74.52,8.91
NEX_RX
  Top 0.254: P22.P$1 4.57,37.49 4.57,40.23 P18.P$1 4.57,40.46 4.57,43.66 P15.P$1 4.57,43.89 4.57,47.09 P11.P$1
NEX_TX
  Top 0.254: P23.P$1 7.09,37.49 7.09,40.23 P19.P$1 7.09,40.46 7.09,43.66 P16.P$1 7.09,43.89 7.09,47.09 P12.P$1
RESET  (via drill 0.61)
  Top 0.254: R5.2 64.92,14.4 64.92,13.03 65.15,12.8 65.15,11.89 64.01,10.74 60.58,10.74 SW2.P$1 | IC2.9 42.98,19.2 41.38,20.8 39.78,20.8 36.12,24.46 36.12,25.83 34.29,27.66 34.29,28.12 C12.2 34.06,28.35 33.38,29.03 | 33.38,29.03 16.46,29.03 P4.P$1 | 33.38,29.03 36.58,32.23 36.58,35.2 33.83,37.95 33.83,45.72 32.92,46.63 32.92,52.35 33.83,53.26 44.81,53.26 45.95,52.12 46.86,52.12 VOLT_HEADER.6 | v77.5,29.26 80.01,26.75 X3.5
  Bottom 0.254: X3.5 80.24,26.52 80.24,25.6 81.38,24.46 81.38,23.77 82.53,22.63 83.21,22.63 83.9,21.95 83.9,9.37 80.47,5.94 65.15,5.94 60.58,10.52 SW2.P$1 | SERIAL.5 2.97,10.29 2.97,11.2 15.09,23.32 15.09,27.89 16.23,29.03 P4.P$1 | v77.5,29.26 77.5,29.95 66.98,40.46 60.35,40.46 53.49,47.32 53.49,54.86 53.03,55.32 50.29,55.32 47.09,52.12 VOLT_HEADER.6
RSV1
  Bottom 0.254: PWR_RSV_1.2 46.41,8.69 37.95,8.69 34.75,5.49 31.32,5.49 30.4,6.4 30.4,10.52 26.98,13.95 16.69,13.95 P25.P$1
RSV2  (via drill 0.61)
  Top 0.254: v33.38,14.63 v38.86,14.63
  Bottom 0.254: v38.86,14.63 40.01,14.63 41.38,13.26 46.41,13.26 PWR_RSV_2.2 | v33.38,14.63 18.52,14.63 16.69,16.46 P26.P$1
RX
  Top 0.254: IC2.14 55.55,18.97 55.55,18.52 53.26,16.23 42.98,16.23 38.41,11.66 38.41,3.89 DIGITAL8_HEADER.8 38.18,3.66 36.12,1.6 16,1.6 14.17,3.43 14.17,5.49 2.97,16.69 2.97,17.6 SERIAL.2
SCK  (via drill 0.61)
  Top 0.254: v14.17,2.06 14.86,2.06 15.77,1.14 37.49,1.14 39.55,3.2 v39.55,5.03 | X3.7 80.01,24.23 80.01,25.15 76.58,28.57 76.58,32 78.41,33.83 78.41,44.12 66.75,55.78 18.52,55.78 13.26,50.52 13.26,31.32 15.09,29.49 15.09,27.89 16.23,26.75 P5.P$1
  Bottom 0.254: IC2.8 40.69,18.97 42.52,17.14 44.58,17.14 48.23,13.49 48.23,8.23 45.03,5.03 v39.55,5.03 35.43,5.03 34.29,3.89 DIGITAL0_HEADER.1 | v14.17,2.06 14.17,17.14 17.37,20.34 17.37,24.69 16.46,25.6 16.46,26.52 P5.P$1
SCL  (via drill 0.61)
  Top 0.254: v67.44,13.26 67.44,12.57 68.58,11.43 68.58,10.06 62.41,3.89 61.27,3.89 P2.P$1
  Bottom 0.254: v67.44,13.26 67.44,20.12 69.04,21.72 69.04,26.75 68.58,27.2 68.58,34.06 IC2.22
SDA
  Bottom 0.254: IC2.23 65.84,34.06 65.84,26.29 59.44,19.89 59.44,12.12 58.75,11.43 58.75,3.89 P1.P$1
TX  (via drill 0.61)
  Top 0.254: IC2.15 58.29,15.09 54.41,11.2 46.86,11.2 40.92,5.26 40.92,3.89 DIGITAL8_HEADER.7 | v35.66,2.52 15.77,2.52 14.63,3.66 14.63,7.77 3.43,18.97 2.29,18.97 1.6,18.29 1.6,17.37 2.74,16.23 2.74,15.32 SERIAL.3
  Bottom 0.254: v35.66,2.52 39.55,2.52 40.69,3.66 DIGITAL8_HEADER.7
VCC  (via drill 0.61)
  Top 0.254: v64.24,12.34 62.18,14.4 R5.1 | PWR_FROM_USB.2 79.1,3.89 79.1,8.69 PWR_FROM_USBASP1.2 | 60.81,39.32 61.72,38.41 61.72,38.18 61.95,37.95 66.06,37.95 67.44,39.32 IC1.3 67.21,39.55 v67.21,41.83 | 60.81,39.32 59.44,40.69 R1.1 | v50.75,37.03 54.41,40.69 C1.1 54.63,40.69 v56.46,38.86 58.29,37.03 62.87,37.03 64.47,35.43 v64.47,22.17 | v60.35,38.86 60.81,39.32 | P21.P$1 9.6,37.49 9.6,40.23 P9.P$1 9.6,40.46 9.6,43.66 P14.P$1 9.6,43.89 9.6,47.09 P10.P$1
  Bottom 0.254: 64.47,12.34 69.49,12.34 71.55,10.29 77.5,10.29 | 77.5,10.29 78.87,8.91 PWR_FROM_USBASP1.2 | 77.5,10.29 78.87,11.66 78.87,13.26 PWR_FROM_VIN.2 | 48.01,34.29 v50.75,37.03 | 48.01,34.29 46.18,36.12 42.75,36.12 42.06,35.43 42.06,33.15 45.49,29.72 45.49,19.2 IC2.10 | 48.01,34.29 IC2.30 | v56.46,38.86 v60.35,38.86 | v64.47,22.17 64.47,12.34 | 64.47,12.34 v64.24,12.34 | P21.P$1 9.6,37.26 9.6,29.03 13.72,24.92 13.72,24.23 P7.P$1 13.72,24 2.97,13.26 2.97,12.8 SERIAL.4 | P10.P$1 9.6,47.32 16,53.72 29.03,53.72 32,50.75 37.03,50.75 37.95,51.66 37.95,52.35 38.86,53.26 39.78,53.26 40.92,52.12 41.6,52.12 VOLT_HEADER.4 41.83,52.12 45.49,55.78 53.26,55.78 v67.21,41.83
VIN
  Top 0.254: VOLT_HEADER.1 34.29,51.89 34.29,40.92 36.35,38.86 C5.+ | D1.C 46.18,47.55 46.18,45.49 44.58,43.89 44.58,42.75 40.69,38.86 C3.1
  Bottom 0.254: C3.1 40.46,38.86 36.58,38.86 C5.+ 36.35,38.86 34.75,40.46 31.32,40.46 IC3.1
X1_32
  Top 0.254: 53.26,25.38 52.81,25.38 51.66,26.52 Q3.2 | 53.26,25.38 56.01,25.38 C10.2 | 53.26,25.38 53.26,19.2 IC2.13
X2_32
  Top 0.254: C11.2 37.49,25.6 40.92,25.6 41.83,26.52 Q3.1 42.06,26.52 44.81,26.52 50.52,20.8 50.52,19.2 IC2.12

### Text on the board
tPlace: 5 | 4 | 3 | 2 | 1 | 0 | VIN | G | G | 5V | 3V | RST | G | RX | TX | 5V | 13 | 5V | ASP | USB | G | R | MO | S | V | MI | DTR | RX | LOCK.2 | TX | LOCK.1 | 5V | VIN | RST | 23 | 22 | 21 | 20 | 19 | 18 | A6 | A7 | ASP | GND | RX | TX | USB | 0 | 1 | 2 | 3 | 4 | 5 | 6 | 7 | 8 | 9 | 10 | 11 | 12 | 13 | G | A | SDA | SCL